# EAGLE schematic Aquarium-controller (EAGLE 7.7.0)
AUTHOR: Greg; CNAME: TEst
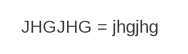
[diagram p0: schematic, sheet 1, part 1 of 2]
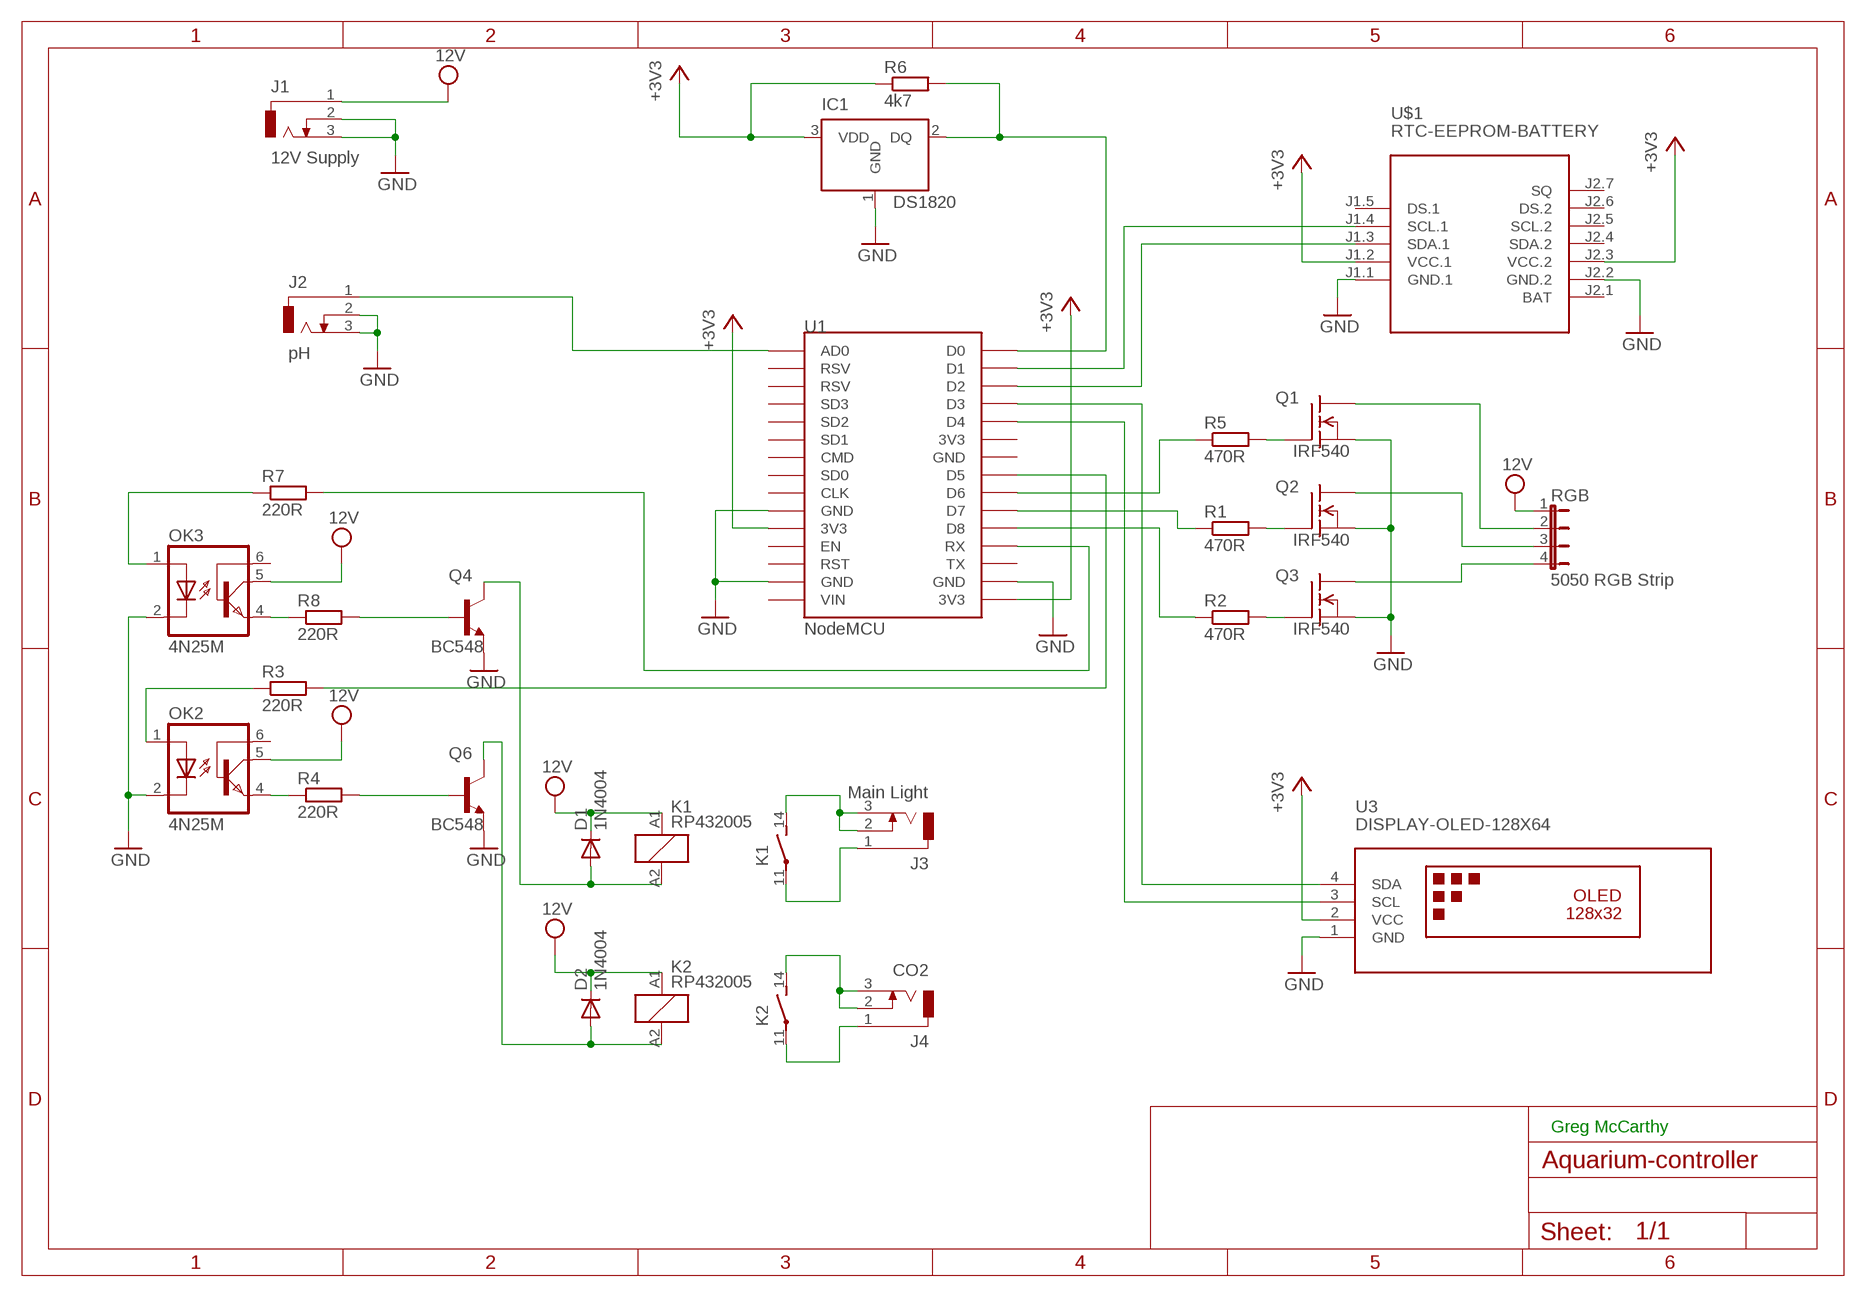
[diagram p1: schematic, sheet 1, part 2 of 2]
FRAME1 (A4L-LOC): JHGJHG: jhgjhg

## Parts
D1  1N4004  [DO41-10]
D2  1N4004  [DO41-10]
IC1  DS1820  [TO-92]
J1  12V Supply  DCJ0202  [DCJ0202]
J2  pH  DCJ0202  [DCJ0202]
J3  Main Light  DCJ0202  [DCJ0202]
J4  CO2  DCJ0202  [DCJ0202]
K1  RP432005  [RT-N/O12A3.5]
K2  RP432005  [RT-N/O12A3.5]
OK2  4N25M  [DIL06]
OK3  4N25M  [DIL06]
Q1  IRF540  [TO220]
Q2  IRF540  [TO220]
Q3  IRF540  [TO220]
Q4  BC548  [TO92-EBC]
Q6  BC548  [TO92-EBC]
R1  470R  R0204/7  [0204/7]
R2  470R  R0204/7  [0204/7]
R3  220R  R0204/7  [0204/7]
R4  220R  R0204/7  [0204/7]
R5  470R  R0204/7  [0204/7]
R6  4k7  R0204/7  [0204/7]
R7  220R  R0204/7  [0204/7]
R8  220R  R0204/7  [0204/7]
RGB  5050 RGB Strip  JP4E  [JP4]
U1  NodeMCU  ESP12E_DEVKIT  [ESP12E_DEVKIT]
U3  DISPLAY-OLED-128X64  DISPLAY-OLED-128X32  [DISPLAY-OLED-128X32]
U$1  RTC-EEPROM-BATTERY  [RTC-EEPROM-BATTERY]

## Nets
+3V3: IC1.3(VDD) R6.1 U1.3V3@0(3V3) U1.3V3@2(3V3) U3.2(VCC) U$1.J1.2(VCC.1) U$1.J2.3(VCC.2)
GND: IC1.1(GND) J1.2 J1.3 J2.2 J2.3 OK2.2(C) OK3.2(C) Q1.3(S) Q2.3(S) Q3.3(S) Q4.E Q6.E U1.GND@0(GND) U1.GND@1(GND) U1.GND@3(GND) U3.1(GND) U$1.J1.1(GND.1) U$1.J2.2(GND.2)
N$1: J2.1 U1.AD0
N$2: Q1.1(G) R5.2
N$3: Q2.1(G) R1.2
N$4: Q3.1(G) R2.2
N$5: R5.1 U1.D6
N$6: R1.1 U1.D7
N$7: R2.1 U1.D8
N$8: IC1.2(DQ) R6.2 U1.D0
N$9: U1.D1 U$1.J1.4(SCL.1)
N$10: U1.D2 U$1.J1.3(SDA.1)
N$11: U1.D3 U3.4(SDA)
N$12: U1.D4 U3.3(SCL)
N$13: OK3.1(A) R7.1
N$14: OK2.1(A) R3.1
N$15: R7.2 U1.RX
N$16: R3.2 U1.D5
N$17: OK3.4(EMI) R8.1
N$18: OK2.4(EMI) R4.1
N$19: Q4.B R8.2
N$20: Q6.B R4.2
N$21: D1.A K1.A2 Q4.C
N$22: D2.A K2.A2 Q6.C
N$23: J4.2 J4.3 K2.14(2:S)
N$24: J3.2 J3.3 K1.14(2:S)
N$25: J4.1 K2.11(2:P)
N$26: J3.1 K1.11(2:P)
N$27: Q1.2(D) RGB.2
N$28: Q2.2(D) RGB.3
N$29: Q3.2(D) RGB.4
VCC: D1.C D2.C J1.1 K1.A1 K2.A1 OK2.5(COL) OK3.5(COL) RGB.1 ; supply symbol labelled 12V
Unconnected: OK2.6(BAS) OK3.6(BAS) U1.3V3@1(3V3) U1.CLK U1.CMD U1.EN U1.GND@2(GND) U1.RST U1.RSV@0(RSV) U1.RSV@1(RSV) U1.SD0 U1.SD1 U1.SD2 U1.SD3 U1.TX U1.VIN U$1.J1.5(DS.1) U$1.J2.1(BAT) U$1.J2.4(SDA.2) U$1.J2.5(SCL.2) U$1.J2.6(DS.2) U$1.J2.7(SQ)

## Notes on the sheet
- Greg McCarthy

## Library data of the parts
D1 D2 = diode:1N4004: DIODE general purpose rectifier, 1 A
IC1 = DS1820:DS1820: DS1820 - 1-Wire Digital Thermometer
J1-J4 = con-jack:DCJ0202: DC POWER JACK Source: DCJ0202.pdf; OC_FARNELL: unknown; OC_NEWARK: unknown
K1 K2 = relay:RP?32*: Power PCB Relay RP II/1 SCHRACK 1 pole 8 / 12 A Source: http://www.schrack.com/.. 5834.pdf; OC_FARNELL: unknown; OC_NEWARK: unknown
OK2 OK3 = optocoupler1:4N*?M: General Purpose 6-Pin Phototransistor Optocouplers Source: http://www.fairchildsemi.com/ds/4N/4N35-M.pdf; MPN: 4N25-M; OC_FARNELL: 1021349; OC_NEWARK: 98K9084
Q1-Q3 = transistor-fet:IRF540: N-Channel Enhancement MOSFET (HEXFET); 100V; 28A; 0,077Ohm
Q4 Q6 = transistor-npn:BC548*: NPN Transistor
R1-R8 = eagle-ltspice:R: RESISTOR, European symbol; SPICEMODEL: NONE; SPICEPREFIX: R
RGB = jumper:JP4E: JUMPER
U1 = ESP12E_DEVKIT:ESP12E_DEVKIT: ESP12E DEVKIT BOARD
U3 = diy-modules:DISPLAY-OLED-128X32: 128x32 Dot Matrix OLED Module with I2C interface based on SSD1306 chip More details available here: http://www.tinyosshop.com/index.php?route=product/product&product_id=953 Schematic available here: http://www.tinyosshop.com/datasheet/OLED%2012832.pdf SSD1306 datasheet: https://cdn-shop.adafruit.com/datasheets/SSD1306.pdf Click here to find device on ebay.com <http://www.ebay.com/sch/oled+display+128x32+i2c>
U$1 = diy-modules:RTC-EEPROM-BATTERY: RTC Module with Battery and EEPROM based on DS1307 and AT24C32 chips More details available here: http://henrysbench.capnfatz.com/henrys-bench/arduino-sensors-and-input/arduino-tiny-rtc-d1307-tutorial/ Click here to find device on ebay.com <http://www.ebay.com/sch/tiny+rtc+arduino>